# EAGLE design ftdiBreakout (EAGLE 5.11)
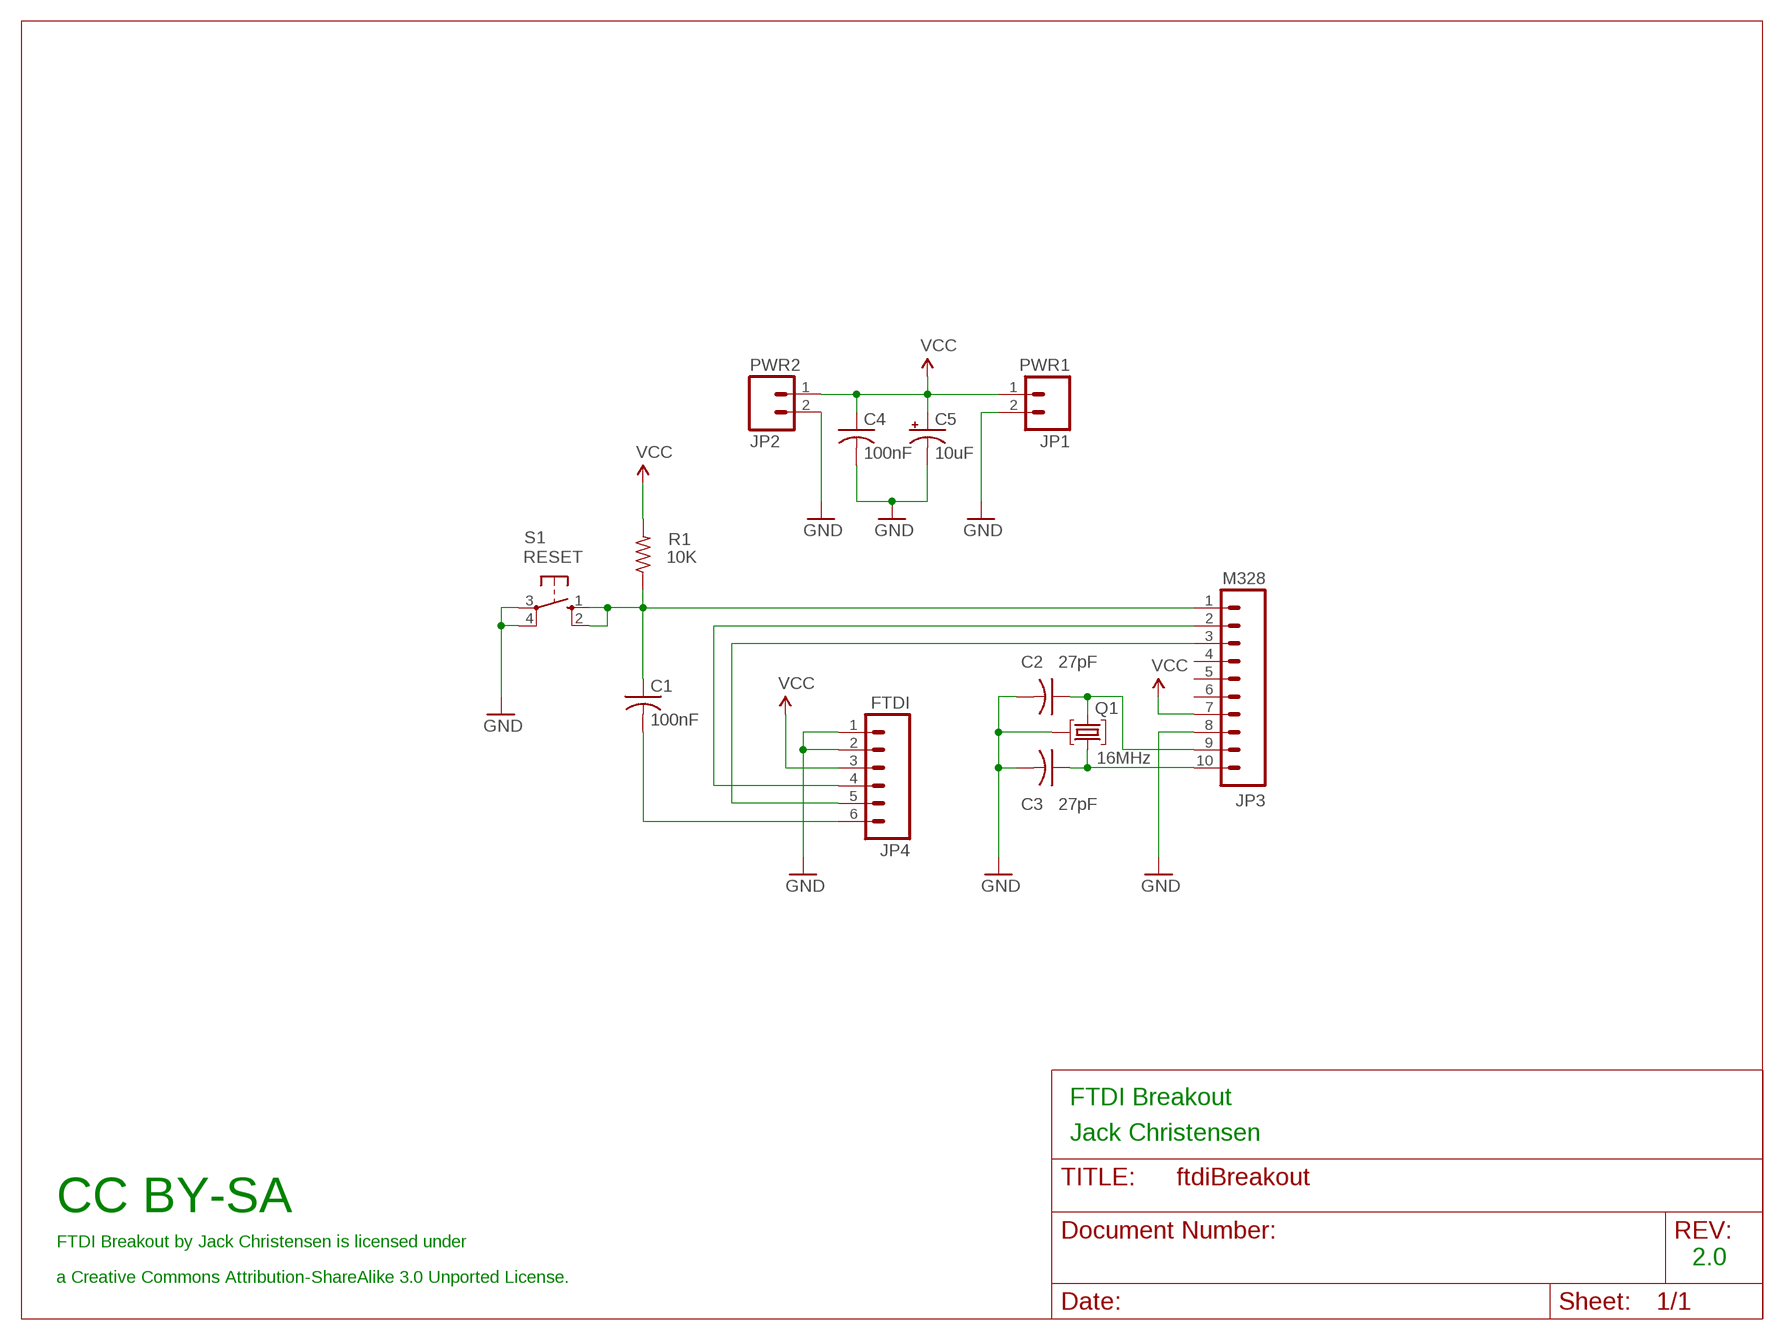
[diagram p0: schematic, sheet 1]

## Parts
C1  100nF  C-US025-025X050  [C025-025X050]
C2  27pF  C-US025-025X050  [C025-025X050]
C3  27pF  C-US025-025X050  [C025-025X050]
C4  100nF  C-US025-025X050  [C025-025X050]
C5  10uF  CPOL-USE2.5-5  [E2,5-5]
JP1  PWR1  M02PTH  [1X02]
JP2  PWR2  M02PTH  [1X02]
JP3  M328  M10"  [1X10]
JP4  FTDI  M06SIP  [1X06]
Q1  16MHz  RESONATOR  [RESONATOR]
R1  10K  R-US_0204/5  [0204/5]
S1  RESET  10-XXOCT  [B3F-10XXOCT]

## Nets
/RESET: C1.1 JP3.1 R1.1 S1.1(S) S1.2(S1)
GND: C2.2 C3.2 C4.2 C5.- JP1.2 JP2.2 JP3.8 JP4.1 JP4.2 Q1.P$1 S1.3(P) S1.4(P1)
RST: C1.2 JP4.6
RXD: JP3.2 JP4.4
TXD: JP3.3 JP4.5
VCC: C4.1 C5.+ JP1.1 JP2.1 JP3.7 JP4.3 R1.2
XTAL1: C2.1 JP3.9 Q1.P$2
XTAL2: C3.1 JP3.10 Q1.P$3
Unconnected: JP3.4 JP3.5 JP3.6

## Notes on the sheet
- FTDI Breakout
- Jack Christensen
- CC BY-SA
- FTDI Breakout by Jack Christensen is licensed under
- 2.0
- a Creative Commons Attribution-ShareAlike 3.0 Unported License.

## Library data of the parts
C1-C4 = adafruit:C-US: CAPACITOR, American symbol
C5 = rcl:CPOL-US: POLARIZED CAPACITOR, American symbol
JP1 JP2 = SparkFun:M02: Header 2 Standard 2-pin 0.1" header. Use with straight break away headers (SKU : PRT-00116), right angle break away headers (PRT-00553), swiss pins (PRT-00743), machine pins (PRT-00117), and female headers (PRT-00115). Molex polarized connector foot print use with SKU : PRT-08233 with associated crimp pins and housings.
JP3 = SparkFun:M10: Header 10 Standard 10-pin 0.1" header. Use with straight break away headers (SKU : PRT-00116), right angle break away headers (PRT-00553), swiss pins (PRT-00743), machine pins (PRT-00117), and female headers (PRT-00115).
JP4 = SparkFun:M06: Header 6 Standard 6-pin 0.1" header. Use with straight break away headers (SKU : PRT-00116), right angle break away headers (PRT-00553), swiss pins (PRT-00743), machine pins (PRT-00117), and female headers (PRT-00115). Molex polarized connector foot print use with SKU : PRT-08094 with associated crimp pins and housings. NOTES ON THE VARIANTS LOCK and LOCK_LONGPADS... This footprint was designed to help hold the alignment of a through-hole component (i.e. 6-pin header) while soldering it into place. You may notice that each hole has been shifted either up or down by 0.005 of an inch from it's more standard position (which is a perfectly straight line). This slight alteration caused the pins (the squares in the middle) to touch the edges of the holes. Because they are alternating, it causes a "brace" to hold the component in place. 0.005 has proven to be the perfect amount of "off-center" position when using our standard breakaway headers. Although looks a little odd when you look at the bare footprint, once you have a header in there, the alteration is very hard to notice. Also, if you push a header all the way into place, it is covered up entirely on the bottom side. This idea of altering the position of holes to aid alignment will be further integrated into the Sparkfun Library for other footprints. It can help hold any component with 3 or more connection pins.
Q1 = _jc:RESONATOR: Ceramic resonator with capacitors or HC49/US crystal
R1 = _jc:R-US_: RESISTOR, American symbol
S1 = _jc:10-XX: OMRON SWITCH

## Board
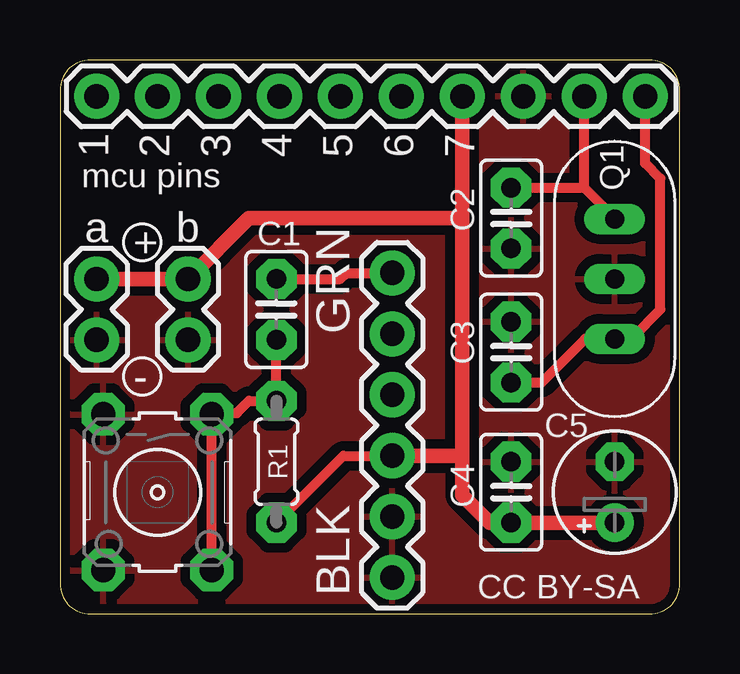
[diagram p1: board, top side]
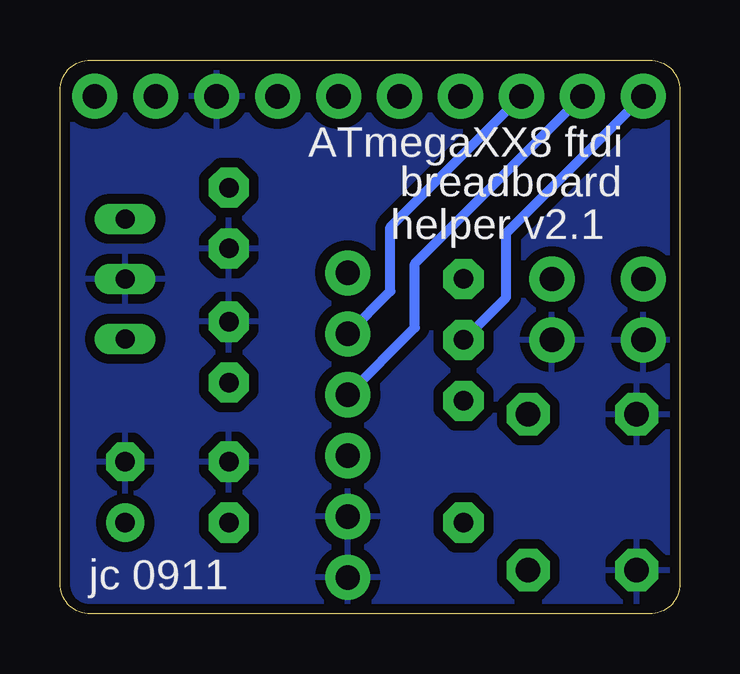
[diagram p2: board, bottom side, seen from below]

Size 25.83 x 23.1 mm. Coordinates in mm from the lower left corner, seen from the top.
Outline: 24.56,0 arc90 25.83,1.27 25.83,21.83 arc90 24.56,23.1 1.27,23.1 arc90 0,21.83 0,1.27 arc90 1.27,0 24.56,0
Copper layers (1*16): Top 0.0356mm / dielectric 1.5011mm / Bottom 0.0356mm
Design rules "LaenPCBOrder *": minimum track width 6mil, minimum drill 13mil, track to track 6mil, track to pad 6mil, pad to pad 6mil, via to via 6mil, smd to smd 6mil, copper to edge 15mil, drill to drill 6mil, minimum pad ring 7mil, minimum via ring 7mil, stop-mask expansion 4mil, vias tented up to drill 0mil, thermal gap 16mil

### Footprints (pad centres in the part's own frame; a part is rotated, then mirrored left to right if it is on the bottom)
C025-025X050 = drill 0.813 pad 1.676 octagon: 1 -1.27,0; 2 1.27,0
E2,5-5 = drill 0.813 pad 1.6 round: + -1.27,0 | drill 0.813 pad 1.6 octagon: - 1.27,0
1X02 = drill 1.016 pad 1.88 round: 1 0,0; 2 2.54,0
1X10 = drill 1.016 pad 1.88 round: 1 0,0; 2 2.54,0; 3 5.08,0; 4 7.62,0; 5 10.16,0; 6 12.7,0; 7 15.24,0; 8 17.78,0; 9 20.32,0; 10 22.86,0
1X06 = drill 1.016 pad 1.88 round: 1 0,0; 2 2.54,0; 3 5.08,0; 4 7.62,0; 5 10.16,0; 6 12.7,0
RESONATOR = drill 0.8 pad 1.27 long: P$1 0,0; P$2 -2.5,0; P$3 2.5,0
0204/5 = drill 0.813 pad 1.676 octagon: 1 -2.54,0; 2 2.54,0
B3F-10XXOCT = drill 1.016 pad 1.778 octagon: 1 -3.251,2.261; 2 3.251,2.261; 3 -3.251,-2.261; 4 3.251,-2.261

### Placement (x,y rotation side)
C1  9.02,12.7 90 top
C2  18.8,16.51 270 top
C3  18.8,10.92 90 top
C4  18.8,5.08 90 top
C5  23.11,5.08 90 top
JP1  1.52,13.97 270 top
JP2  5.33,13.97 270 top
JP3  1.52,21.59 0 top
JP4  13.84,1.52 90 top
Q1  23.11,13.97 270 top
R1  9.02,6.35 270 top
S1  4.06,5.08 270 top

### Tracks (layer width: path | path; a pad name or v marks a point on that pad's centre or on a via)
/RESET
  Top 0.406: S1.2 S1.1 6.38,8.38 7.37,8.38 7.87,8.89 R1.1 C1.1
  Bottom 0.406: JP3.1 7.24,15.88 7.24,13.21 C1.1
GND
  pour Bottom (isolate 0.406): 1.27,23.11 24.64,23.11 arc-90 25.91,21.84 25.91,1.14 arc-90 24.77,0 1.27,0 arc-90 0,1.27 0,21.97 arc-90 1.14,23.11
  pour Top (isolate 0.406): 1.14,23.11 24.64,23.11 arc-90 25.91,21.84 25.91,1.14 arc-90 24.77,0 1.27,0 arc-90 0,1.27 0,21.97 arc-90
RST
  Top 0.406: JP4.6 11.94,14.22 11.68,13.97 C1.2
RXD
  Bottom 0.406: JP3.2 11.05,14.61 11.05,11.94 JP4.4
TXD
  Bottom 0.406: JP3.3 12.06,16.13 12.06,13.46 JP4.5
VCC
  Top 0.152: C4.1 18.9,4.06 18.9,3.81
  Top 0.406: JP4.3 11.81,6.6 R1.2
  Top 0.61: 16.76,6.6 16.76,16.51 | 16.76,16.51 JP3.7 | JP4.3 16.76,6.6 | 16.76,6.6 16.76,4.95 17.91,3.81 C4.1 18.9,3.81 C5.+ | JP1.1 JP2.1 7.87,16.51 16.76,16.51
XTAL1
  Top 0.152: 22.96,16.66 Q1.P$2
  Top 0.406: 21.84,17.78 JP3.9 | C2.1 21.84,17.78 | 21.84,17.78 22.96,16.66 23.11,16.51
XTAL2
  Top 0.406: C3.1 20.07,9.65 21.88,11.47 Q1.P$3 23.2,11.56 23.88,11.56 25.02,12.7 25.02,18.16 24.38,18.8 JP3.10

### Text on the board
tPlace: 1 | 2 | 3 | 4 | 5 | 6 | 7 | mcu pins | a | + | b | GRN | - | BLK | CC BY-SA
bPlace: ATmegaXX8 ftdi | breadboard | helper v2.1 | jc 0911